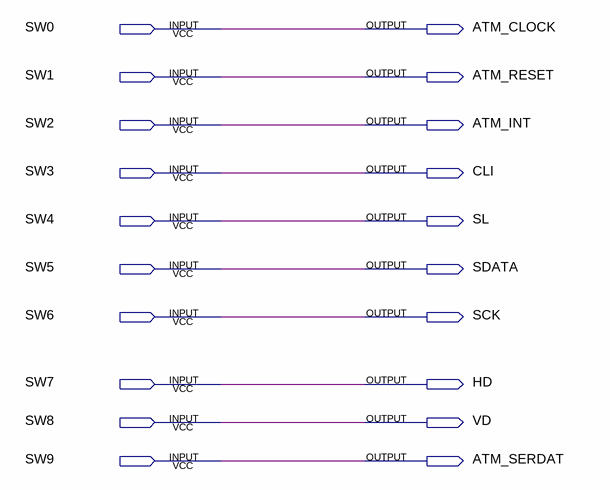
[diagram p0: schematic sheet]
// Quartus schematic sigfire.bdf as structural Verilog: 0 symbols, 20 pins
module sigfire (
  input  SW0,
  input  SW1,
  input  SW2,
  input  SW3,
  input  SW4,
  input  SW5,
  input  SW6,
  input  SW7,
  input  SW8,
  input  SW9,
  output ATM_CLOCK,
  output ATM_RESET,
  output ATM_INT,
  output CLI,
  output SL,
  output SDATA,
  output SCK,
  output HD,
  output VD,
  output ATM_SERDAT
);


  assign ATM_CLOCK = SW0;
  assign ATM_INT = SW2;
  assign ATM_RESET = SW1;
  assign ATM_SERDAT = SW9;
  assign CLI = SW3;
  assign HD = SW7;
  assign SCK = SW6;
  assign SDATA = SW5;
  assign SL = SW4;
  assign VD = SW8;
endmodule
